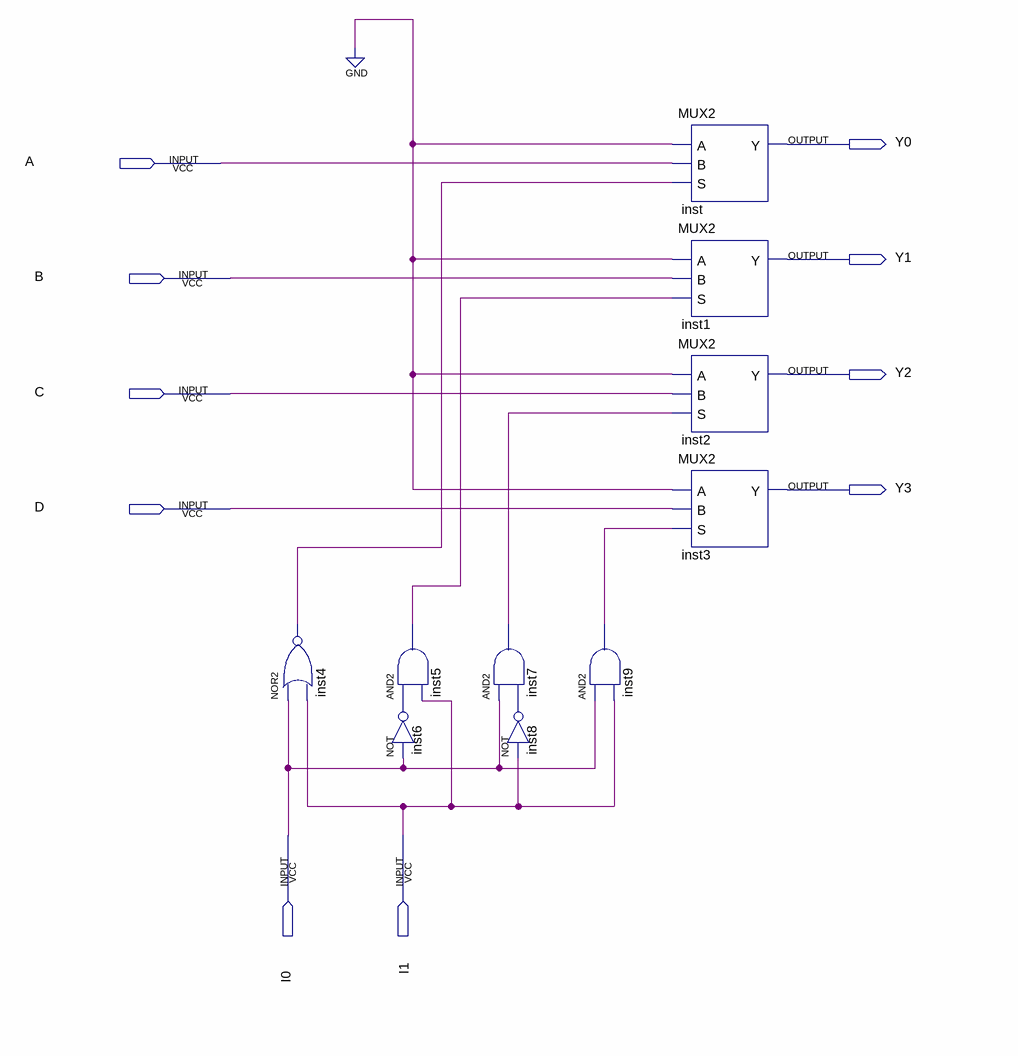
[diagram p0: schematic sheet]
// Quartus schematic MUX4.bdf as structural Verilog: 10 symbols, 10 pins
module MUX4 (
  input  A,
  input  B,
  input  C,
  input  D,
  input  I0,
  input  I1,
  output Y0,
  output Y1,
  output Y2,
  output Y3
);

  wire inst4_out, inst5_out, inst6_out, inst7_out, inst8_out, inst9_out;

  nor inst4 (inst4_out, I0, I1);
  and inst5 (inst5_out, inst6_out, I1);
  not inst6 (inst6_out, I0);
  and inst7 (inst7_out, I0, inst8_out);
  not inst8 (inst8_out, I1);
  and inst9 (inst9_out, I0, I1);
  MUX2 inst (.A(1'b0), .B(A), .S(inst4_out), .Y(Y0));
  MUX2 inst1 (.A(1'b0), .B(B), .S(inst5_out), .Y(Y1));
  MUX2 inst2 (.A(1'b0), .B(C), .S(inst7_out), .Y(Y2));
  MUX2 inst3 (.A(1'b0), .B(D), .S(inst9_out), .Y(Y3));
endmodule
